# EasyEDA schematic Astable multivibrator_2021-06-04.json
TITLE: Astable multivibrator; REV: 1.0; Date: 2021-06-04; Sheet: 1/1; Drawn By: Ferrie Bank; Company: github.com/oudesnepelaar
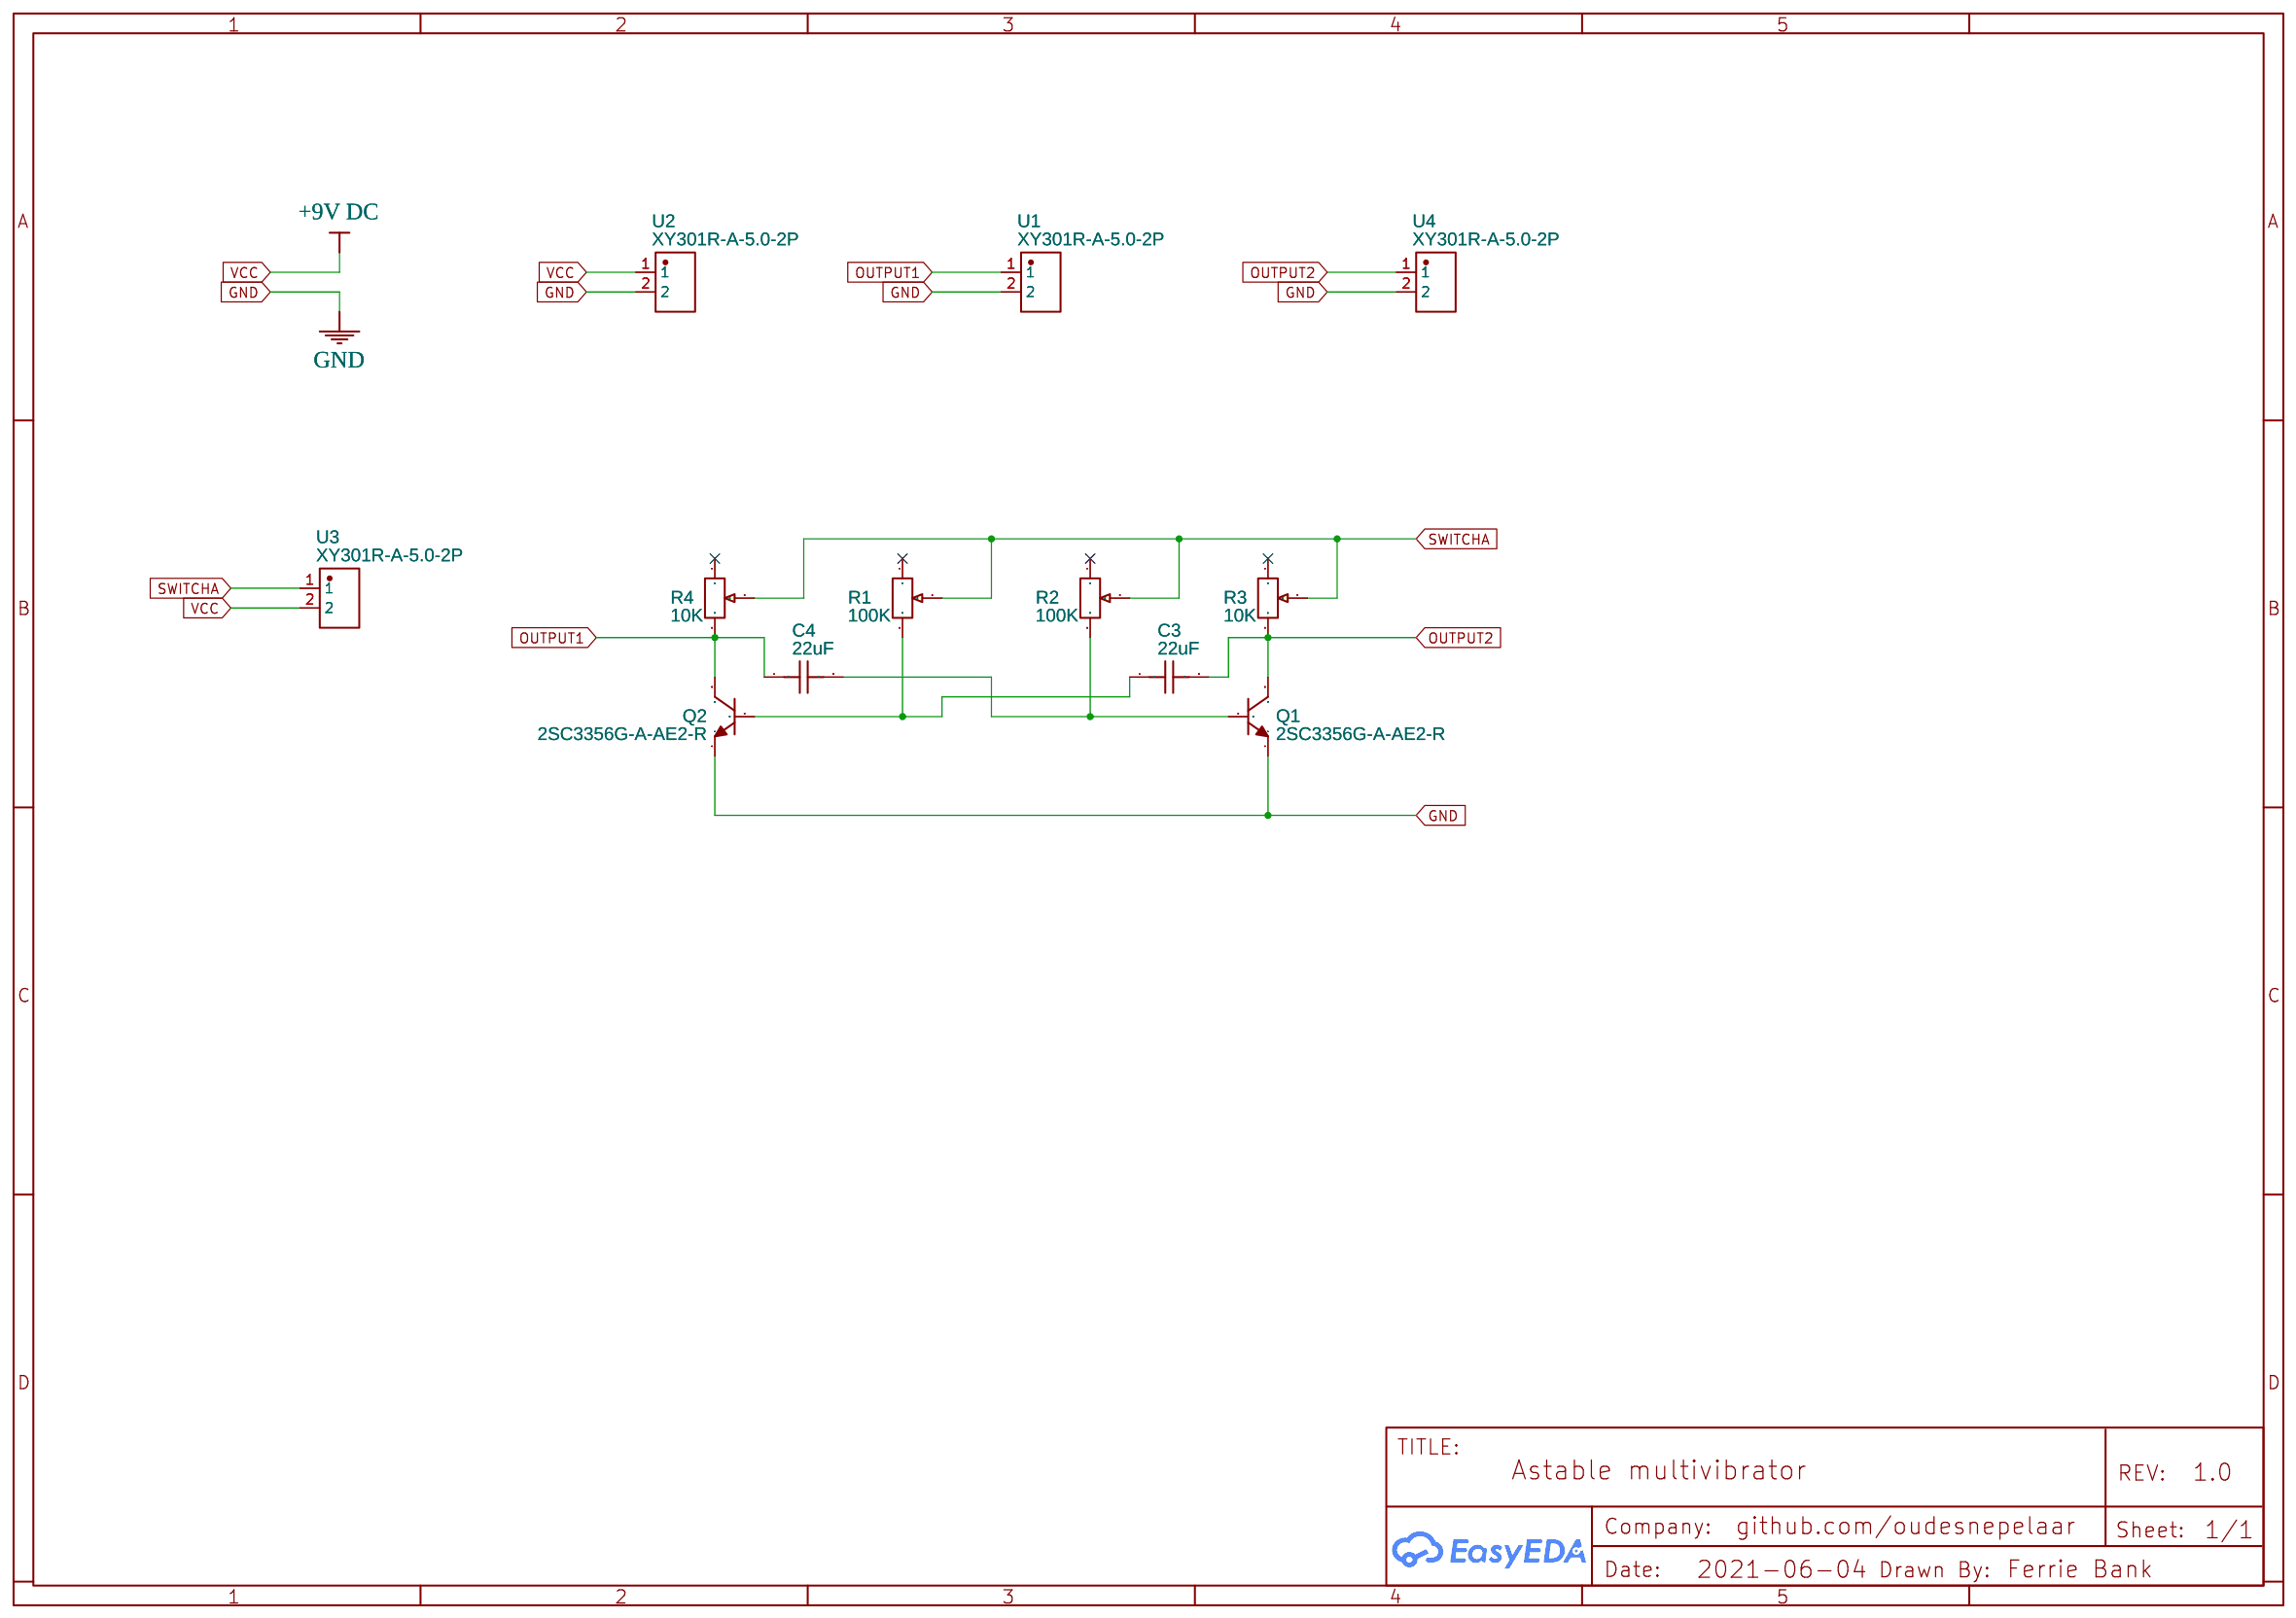
[diagram p0: schematic sheet]

## Parts
C3  22uF  [C0805]
C4  22uF  [C0805]
Q1  2SC3356G-A-AE2-R  [SOT-23-3_L2.9-W1.6-P1.90-LS2.8-TR-CW]
Q2  2SC3356G-A-AE2-R  [SOT-23-3_L2.9-W1.6-P1.90-LS2.8-TR-CW]
R1  100K  [RES-ADJ-TH_3P-L5.0-W4.5-P2.35-TR]
R2  100K  [RES-ADJ-TH_3P-L5.0-W4.5-P2.35-TR]
R3  10K  [RES-ADJ-TH_3P-L5.0-W4.5-P2.35-TR]
R4  10K  [RES-ADJ-TH_3P-L5.0-W4.5-P2.35-TR]
U1  XY301R-A-5.0-2P  [CONN-TH_XY301R-A-5.0-2P]
U2  XY301R-A-5.0-2P  [CONN-TH_XY301R-A-5.0-2P]
U3  XY301R-A-5.0-2P  [CONN-TH_XY301R-A-5.0-2P]
U4  XY301R-A-5.0-2P  [CONN-TH_XY301R-A-5.0-2P]

## Library data of the parts
C3 C4 = GRM21BC81C226ME44L: Supplier: LCSC; Supplier Part: C258782; Manufacturer: Murata Electronics; Contributor: LCSC; JLCPCB Part Class: Extended Part
Q1 Q2 = 2SC3356G-A-AE2-R: Supplier: LCSC; Manufacturer: UTC; Contributor: LCSC; Supplier Part: C171546; JLCPCB Part Class: Extended Part
R1 R2 = ST-4ETG 100K OHM (104): Supplier: LCSC; Supplier Part: C132883; Manufacturer: Nidec Copal Elec; Contributor: LCSC; JLCPCB Part Class: Extended Part
R3 R4 = ST-4ETG 10K OHM (103): Supplier: LCSC; Supplier Part: C132882; Manufacturer: Nidec Copal Elec; Contributor: LCSC; JLCPCB Part Class: Extended Part
U1-U4 = XY301R-A-5.0-2P: Supplier: LCSC; Supplier Part: C557653; Manufacturer: --; Contributor: LCSC; JLCPCB Part Class: Extended Part

## Nets
+9V DC: U2.1 U3.2
GND: Q1.1(E) Q2.1(E) U1.2 U2.2 U4.2
OUTPUT1: C4.1 Q2.3(C) R4.3 U1.1
OUTPUT2: C3.2 Q1.3(C) R3.3 U4.1
SWITCHA: R1.2 R2.2 R3.2 R4.2 U3.1
Net-(C3-1): C3.1 Q2.2(B) R1.3
Net-(C4-2): C4.2 Q1.2(B) R2.3

Not connected (* = marked no-connect by the designer): R1 1*; R2 1*; R3 1*; R4 1*
